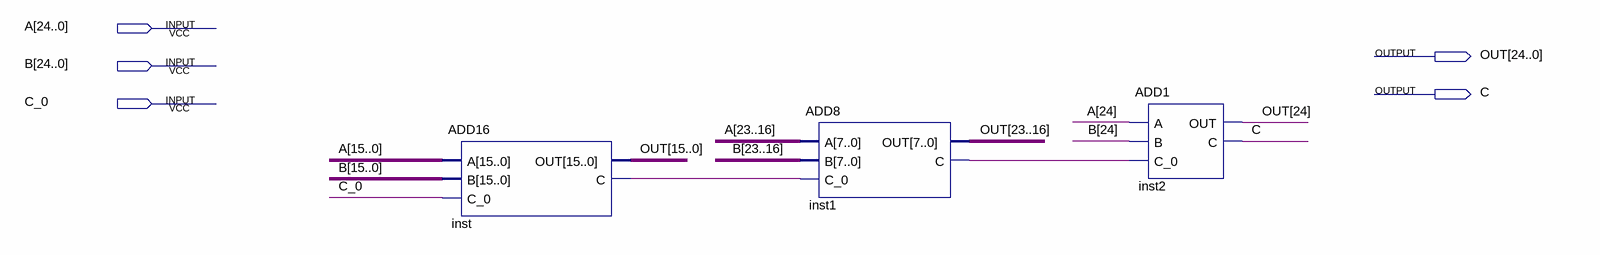
[diagram p0: schematic sheet]
// Quartus schematic ADD25.bdf as structural Verilog: 3 symbols, 5 pins
module ADD25 (
  input  [24:0] A,
  input  [24:0] B,
  input  C_0,
  output [24:0] OUT,
  output C
);

  wire inst1_c, inst_c;

  ADD16 inst (.A(A[15:0]), .B(B[15:0]), .C_0(C_0), .OUT(OUT[15:0]), .C(inst_c));
  ADD8 inst1 (.A(A[23:16]), .B(B[23:16]), .C_0(inst_c), .OUT(OUT[23:16]), .C(inst1_c));
  ADD1 inst2 (.A(A[24]), .B(B[24]), .C_0(inst1_c), .OUT(OUT[24]), .C(C));
endmodule
